# EAGLE schematic WMF SmartPot (EAGLE 9.5.1)
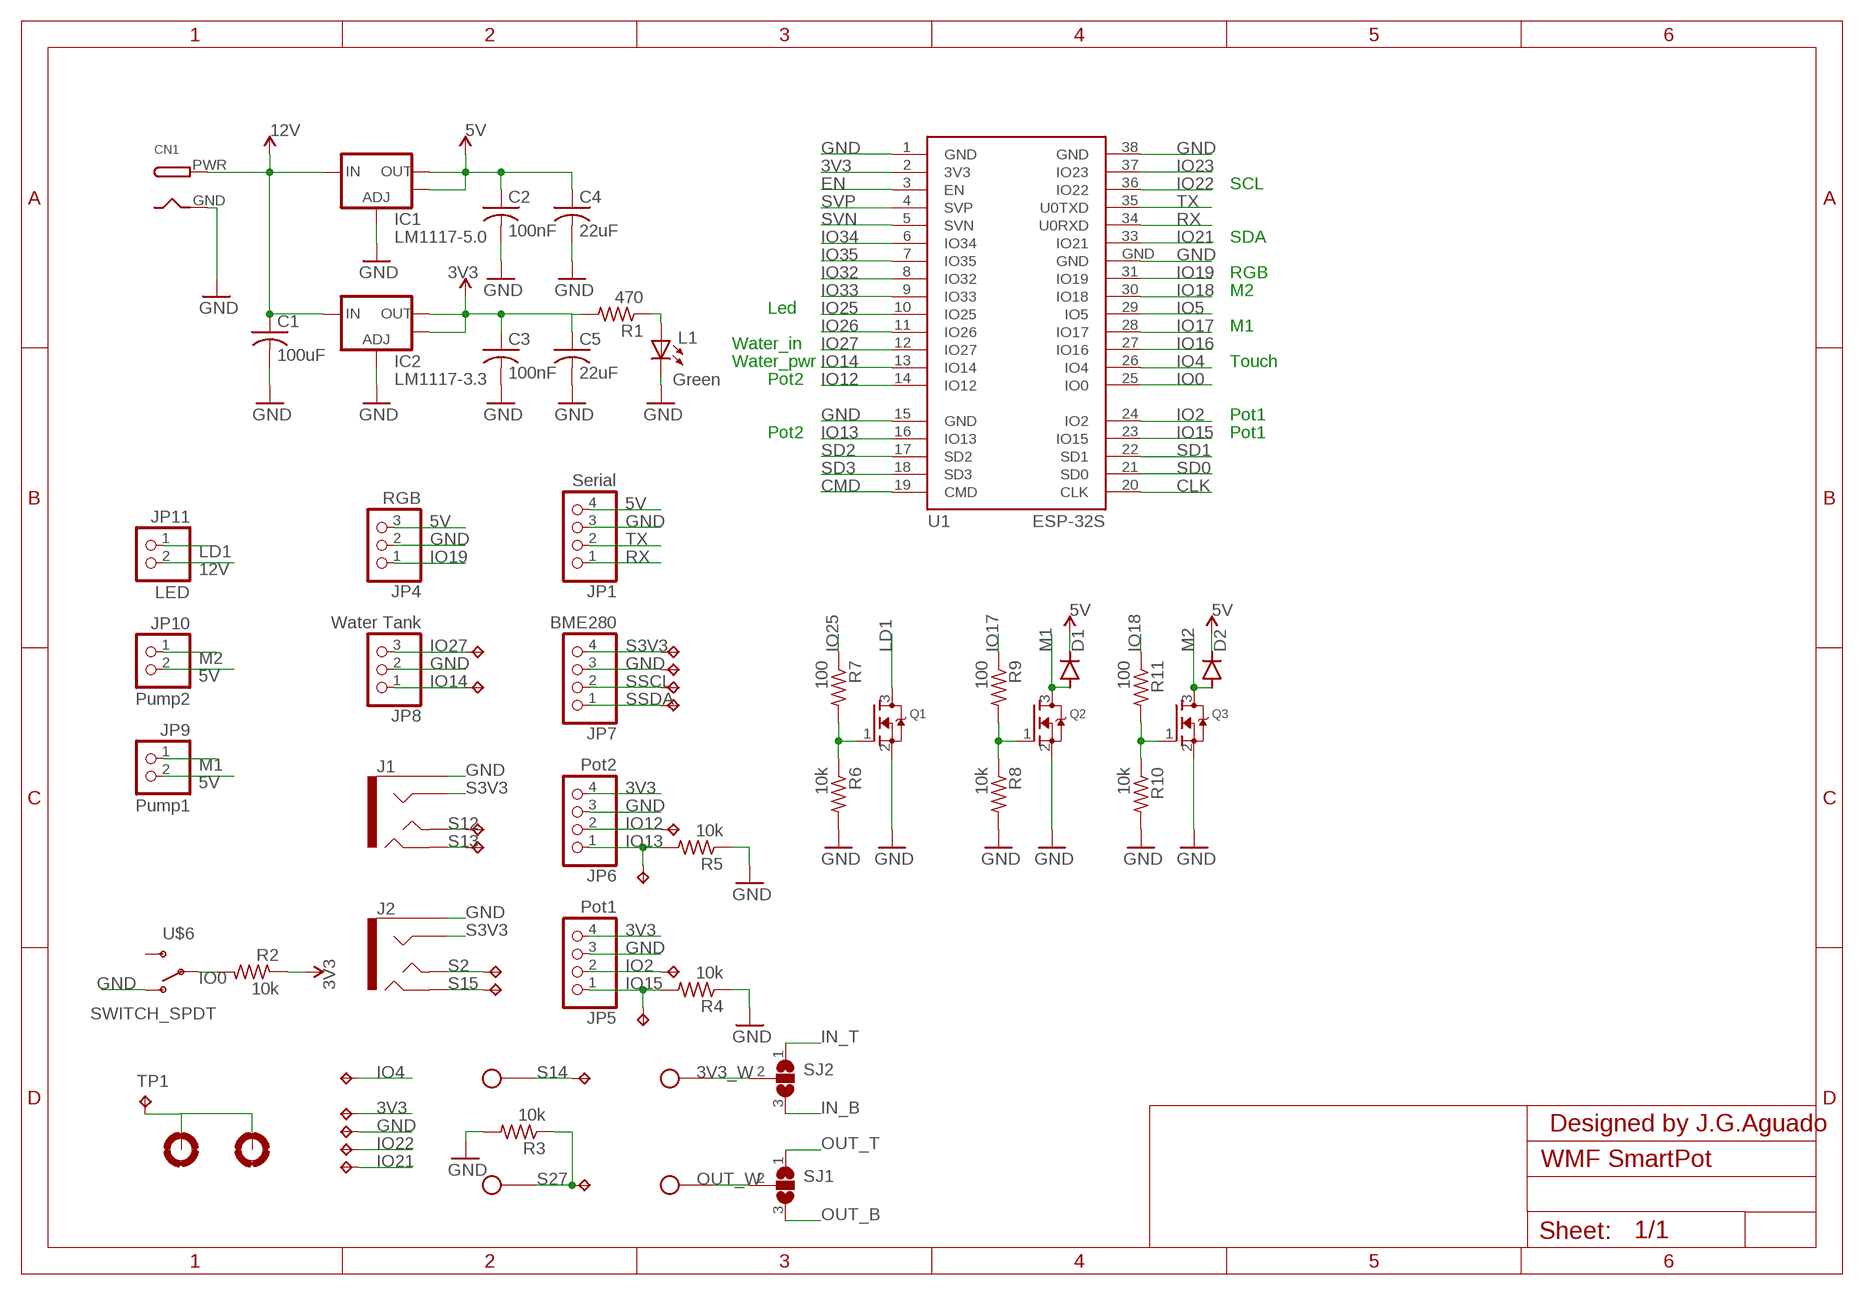
[diagram p0: schematic, sheet 1]

## Parts
C1  100uF  C1206  [1206]
C2  100nF  C1206  [1206]
C3  100nF  C1206  [1206]
C4  22uF  C1206  [1206]
C5  22uF  C1206  [1206]
CN1  DCBARRELPTH  [DCJACK_2MM_PTH]
D1  CGRM4002-G  [SOD-123_MINI-SMA]
D2  CGRM4002-G  [SOD-123_MINI-SMA]
H1  MOUNT-PAD-ROUND2.8  [2,8-PAD]
H2  MOUNT-PAD-ROUND2.8  [2,8-PAD]
IC1  LM1117-5.0  V_REG_LM1117SOT223  [SOT223]
IC2  LM1117-3.3  V_REG_LM1117SOT223  [SOT223]
J1  AUDIO_JACK_TRRSSMD_RA  [AUDIO_JACK_3.5MM_TRRS_SMD_RA]
J2  AUDIO_JACK_TRRSSMD_RA  [AUDIO_JACK_3.5MM_TRRS_SMD_RA]
JP1  Serial  PINHD-1X4  [1X04]
JP4  RGB  PINHD-1X3  [1X03]
JP5  Pot1  PINHD-1X4  [1X04]
JP6  Pot2  PINHD-1X4  [1X04]
JP7  BME280  PINHD-1X4  [1X04]
JP8  Water Tank  PINHD-1X3  [1X03]
JP9  Pump1  PINHD-1X2  [1X02]
JP10  Pump2  PINHD-1X2  [1X02]
JP11  LED  PINHD-1X2  [1X02]
L1  Green  LED1206  [LED1206]
Q1  MOSFET-NREFLOW  [SOT23]
Q2  MOSFET-NREFLOW  [SOT23]
Q3  MOSFET-NREFLOW  [SOT23]
R1  470  R1206  [1206]
R2  10k  R1206  [1206]
R3  10k  R1206  [1206]
R4  10k  R1206  [1206]
R5  10k  R1206  [1206]
R6  10k  R1206  [1206]
R7  100  R1206  [1206]
R8  10k  R1206  [1206]
R9  100  R1206  [1206]
R10  10k  R1206  [1206]
R11  100  R1206  [1206]
SJ1  SJ2W  [SJ_2]
SJ2  SJ2W  [SJ_2]
TP1  TPTP15SQ  [TP15SQ]
TP2  TPTP15SQ  [TP15SQ]
TP3  TPTP15SQ  [TP15SQ]
TP4  TPTP15SQ  [TP15SQ]
TP5  TPTP15SQ  [TP15SQ]
TP6  TPTP15SQ  [TP15SQ]
TP7  TPTP15SQ  [TP15SQ]
TP8  TPTP15SQ  [TP15SQ]
TP9  TPTP15SQ  [TP15SQ]
TP10  TPTP15SQ  [TP15SQ]
TP11  TPTP15SQ  [TP15SQ]
TP12  TPTP15SQ  [TP15SQ]
TP13  TPTP15SQ  [TP15SQ]
TP14  TPTP15SQ  [TP15SQ]
TP15  TPTP15SQ  [TP15SQ]
TP16  TPTP15SQ  [TP15SQ]
TP17  TPTP15SQ  [TP15SQ]
TP18  TPTP15SQ  [TP15SQ]
TP19  TPTP15SQ  [TP15SQ]
TP20  TPTP15SQ  [TP15SQ]
TP21  TPTP15SQ  [TP15SQ]
TP23  TPTP15SQ  [TP15SQ]
U1  ESP-32S  [ESP-32S]
U$2  OVAL_3MM_HOLE  [OVAL_HOLE]
U$3  OVAL_3MM_HOLE  [OVAL_HOLE]
U$4  OVAL_3MM_HOLE  [OVAL_HOLE]
U$5  OVAL_3MM_HOLE  [OVAL_HOLE]
U$6  SWITCH_SPDT  [KPS-1290]

## Nets
3V3: C3.1 C5.1 IC2.2(OUT) IC2.4(OUT) JP5.4 JP6.4 R1.2 R2.1 TP2.TP U1.2(3V3) ; supply symbol labelled VCC
3V3_W: SJ2.2 U$4.P$2
5V: C2.1 C4.1 D1.C D2.C IC1.2(OUT) IC1.4(OUT) JP1.4 JP4.3 JP9.2 JP10.2 ; supply symbol labelled VCC
12V: C1.1 CN1.PWR IC1.3(IN) IC2.3(IN) JP11.2 ; supply symbol labelled VCC
CLK: U1.20(CLK)
CMD: U1.19(CMD)
EN: U1.3(EN)
GND: C1.2 C2.2 C3.2 C4.2 C5.2 CN1.GND IC1.1(ADJ) IC2.1(ADJ) J1.EARTH J2.EARTH JP1.3 JP4.2 JP5.3 JP6.3 JP7.3 JP8.2 L1.C Q1.2(S) Q2.2(S) Q3.2(S) R3.2 R4.1 R5.1 R6.2 R8.2 R10.2 TP3.TP TP7.TP U1.1(GND) U1.15(GND) U1.38(GND) U1.GND U$6.O
IN_B: SJ2.3
IN_T: SJ2.1
IO0: R2.2 U1.25(IO0) U$6.P
IO2: JP5.2 TP15.TP U1.24(IO2)
IO4: TP10.TP U1.26(IO4)
IO5: U1.29(IO5)
IO12: JP6.2 TP14.TP U1.14(IO12)
IO13: JP6.1 R5.2 TP18.TP U1.16(IO13)
IO14: JP8.1 TP13.TP U1.13(IO14)
IO15: JP5.1 R4.2 TP19.TP U1.23(IO15)
IO16: U1.27(IO16)
IO17: R9.1 U1.28(IO17)
IO18: R11.1 U1.30(IO18)
IO19: JP4.1 U1.31(IO19)
IO21: TP5.TP U1.33(IO21)
IO22: TP4.TP U1.36(IO22)
IO23: U1.37(IO23)
IO25: R7.1 U1.10(IO25)
IO26: U1.11(IO26)
IO27: JP8.3 TP11.TP U1.12(IO27)
IO32: U1.8(IO32)
IO33: U1.9(IO33)
IO34: U1.6(IO34)
IO35: U1.7(IO35)
LD1: JP11.1 Q1.3(D)
M1: D1.A JP9.1 Q2.3(D)
M2: D2.A JP10.1 Q3.3(D)
N$1: L1.A R1.1
N$6: Q1.1(G) R6.1 R7.2
N$7: Q2.1(G) R8.1 R9.2
N$8: Q3.1(G) R10.1 R11.2
OUT_B: SJ1.3
OUT_T: SJ1.1
OUT_W: SJ1.2 U$5.P$2
RX: JP1.1 U1.34(U0RXD)
S2: J2.TIP TP20.TP
S3V3: J1.RING1 J2.RING1 JP7.4 TP6.TP
S12: J1.TIP TP16.TP
S13: J1.RING2 TP17.TP
S14: TP12.TP U$2.P$2
S15: J2.RING2 TP21.TP
S27: R3.1 TP23.TP U$3.P$2
SD0: U1.21(SD0)
SD1: U1.22(SD1)
SD2: U1.17(SD2)
SD3: U1.18(SD3)
SSCL: JP7.2 TP8.TP
SSDA: JP7.1 TP9.TP
SVN: U1.5(SVN)
SVP: U1.4(SVP)
TOUCH: H1.B2,8(MOUNT) H2.B2,8(MOUNT) TP1.TP
TX: JP1.2 U1.35(U0TXD)
Unconnected: U$6.S

## Notes on the sheet
- SCL
- SDA
- RGB
- M2
- Led
- M1
- Water_in
- Water_pwr | Touch
- Pot2
- Pot1
- Pot2 | Pot1
- Designed by J.G.Aguado

## Library data of the parts
C1-C5 = SpaceDIY_passive_components:C1206
CN1 = SpaceDIY_connectors:DCBARREL: 2.0mm DC Barrel Jack DCJACK_2MM_PTH - Through Hole Jack (4UConnector: 05537)
D1 D2 = diode:CGRM400*-G: Molded plasitc,JEDEC SOD-123/Mini SMA Source: Comchip CGRM4001-G.pdf
H1 H2 = holes:MOUNT-PAD-ROUND: MOUNTING PAD, round
IC1 IC2 = SparkFun:V_REG_LM1117: Voltage Regulator LM1117 Standard adjustable voltage regulator but in SMD form. Spark Fun Electronics SKU : COM-00595
J1 J2 = SparkFun-Connectors:AUDIO_JACK_TRRS: Audio Jack - 3.5mm TRRS (SMD) This is a 3.5mm TRRS SMD audio jack. TRRS connectors are the audio-style connectors that you see on some phones, MP3 players and development boards. TRRS stands for “tip, ring, ring, sleeve,” which reflects that this has three conductors and a ground. SparkFun Products: Audio Jack <https://www.sparkfun.com/products/12639> mbed Starter Kit <https://www.sparkfun.com/products/12968> SparkFun TRRS 3.5mm Jack Breakout <https://www.sparkfun.com/products/11570>; PROD_ID: CONN-10676; SF_ID: PRT-12639
JP1 JP5-JP7 = SpaceDIY_connectors:PINHD-1X4: PIN HEADER
JP4 JP8 = SpaceDIY_connectors:PINHD-1X3: PIN HEADER
JP9-JP11 = SpaceDIY_connectors:PINHD-1X2: PIN HEADER
L1 = SpaceDIY_passive_components:LED1206
Q1-Q3 = adafruit:MOSFET-N: N-Channel Mosfet 2N7002E - 60V 260mA SOT23 [Digikey: 2N7002ET1GOSTR-ND] - REEL BSH103 - 30V 850mA SOT23 [Digikey: 568-5013-1-ND]
R1-R11 = SpaceDIY_passive_components:R1206
SJ1 SJ2 = jumper:SJ2W: SMD solder JUMPER
TP1-TP21 TP23 = testpad:TP: Test pad
U1 = esp32:ESP-32S: Ai-Thinker ESP-32S
U$2-U$5 = SpaceDIY_connectors:OVAL_3MM_HOLE
U$6 = SparkFun-Retired:SWITCH_SPDT: SWCH-10651 Side-actuated SPDT slide switch, as used on the Arduino Pro; PROD_ID: SWCH-10651